# EAGLE design bl_dora2 (EAGLE 9.6.2)
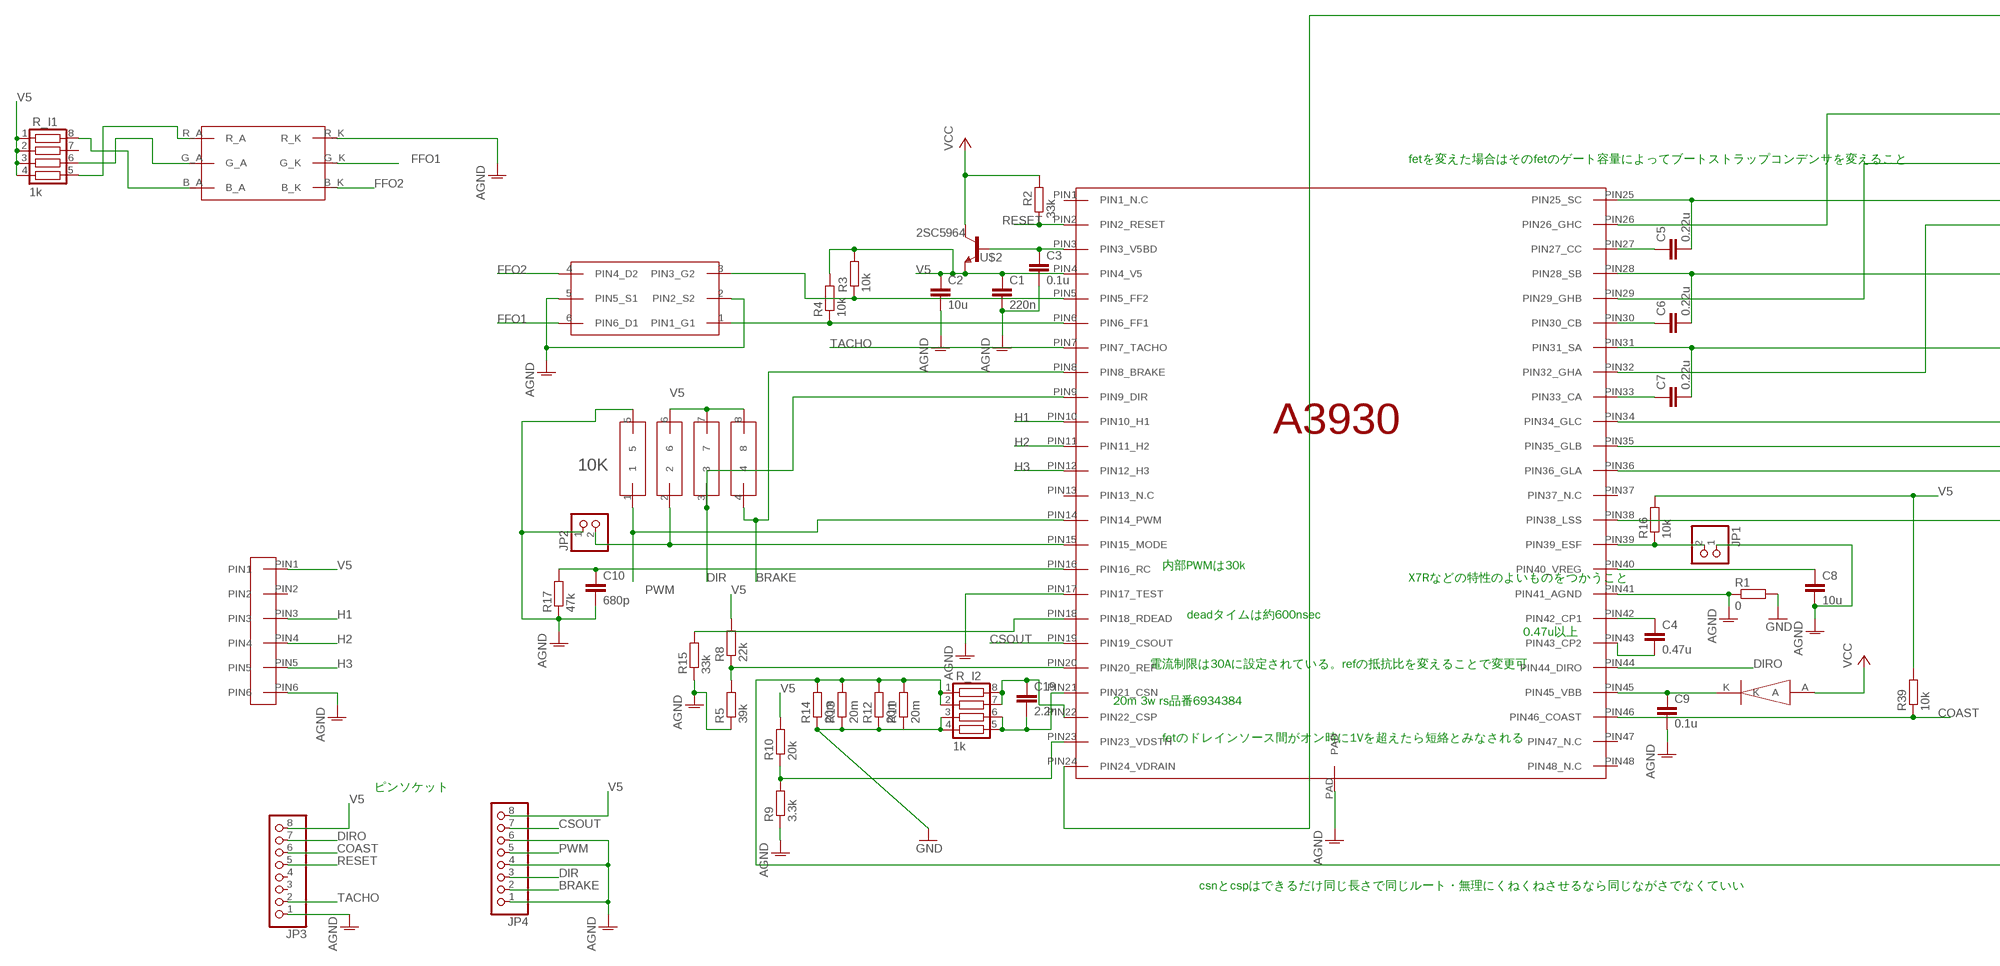
[diagram p0: schematic, sheet 1, part 1 of 2]
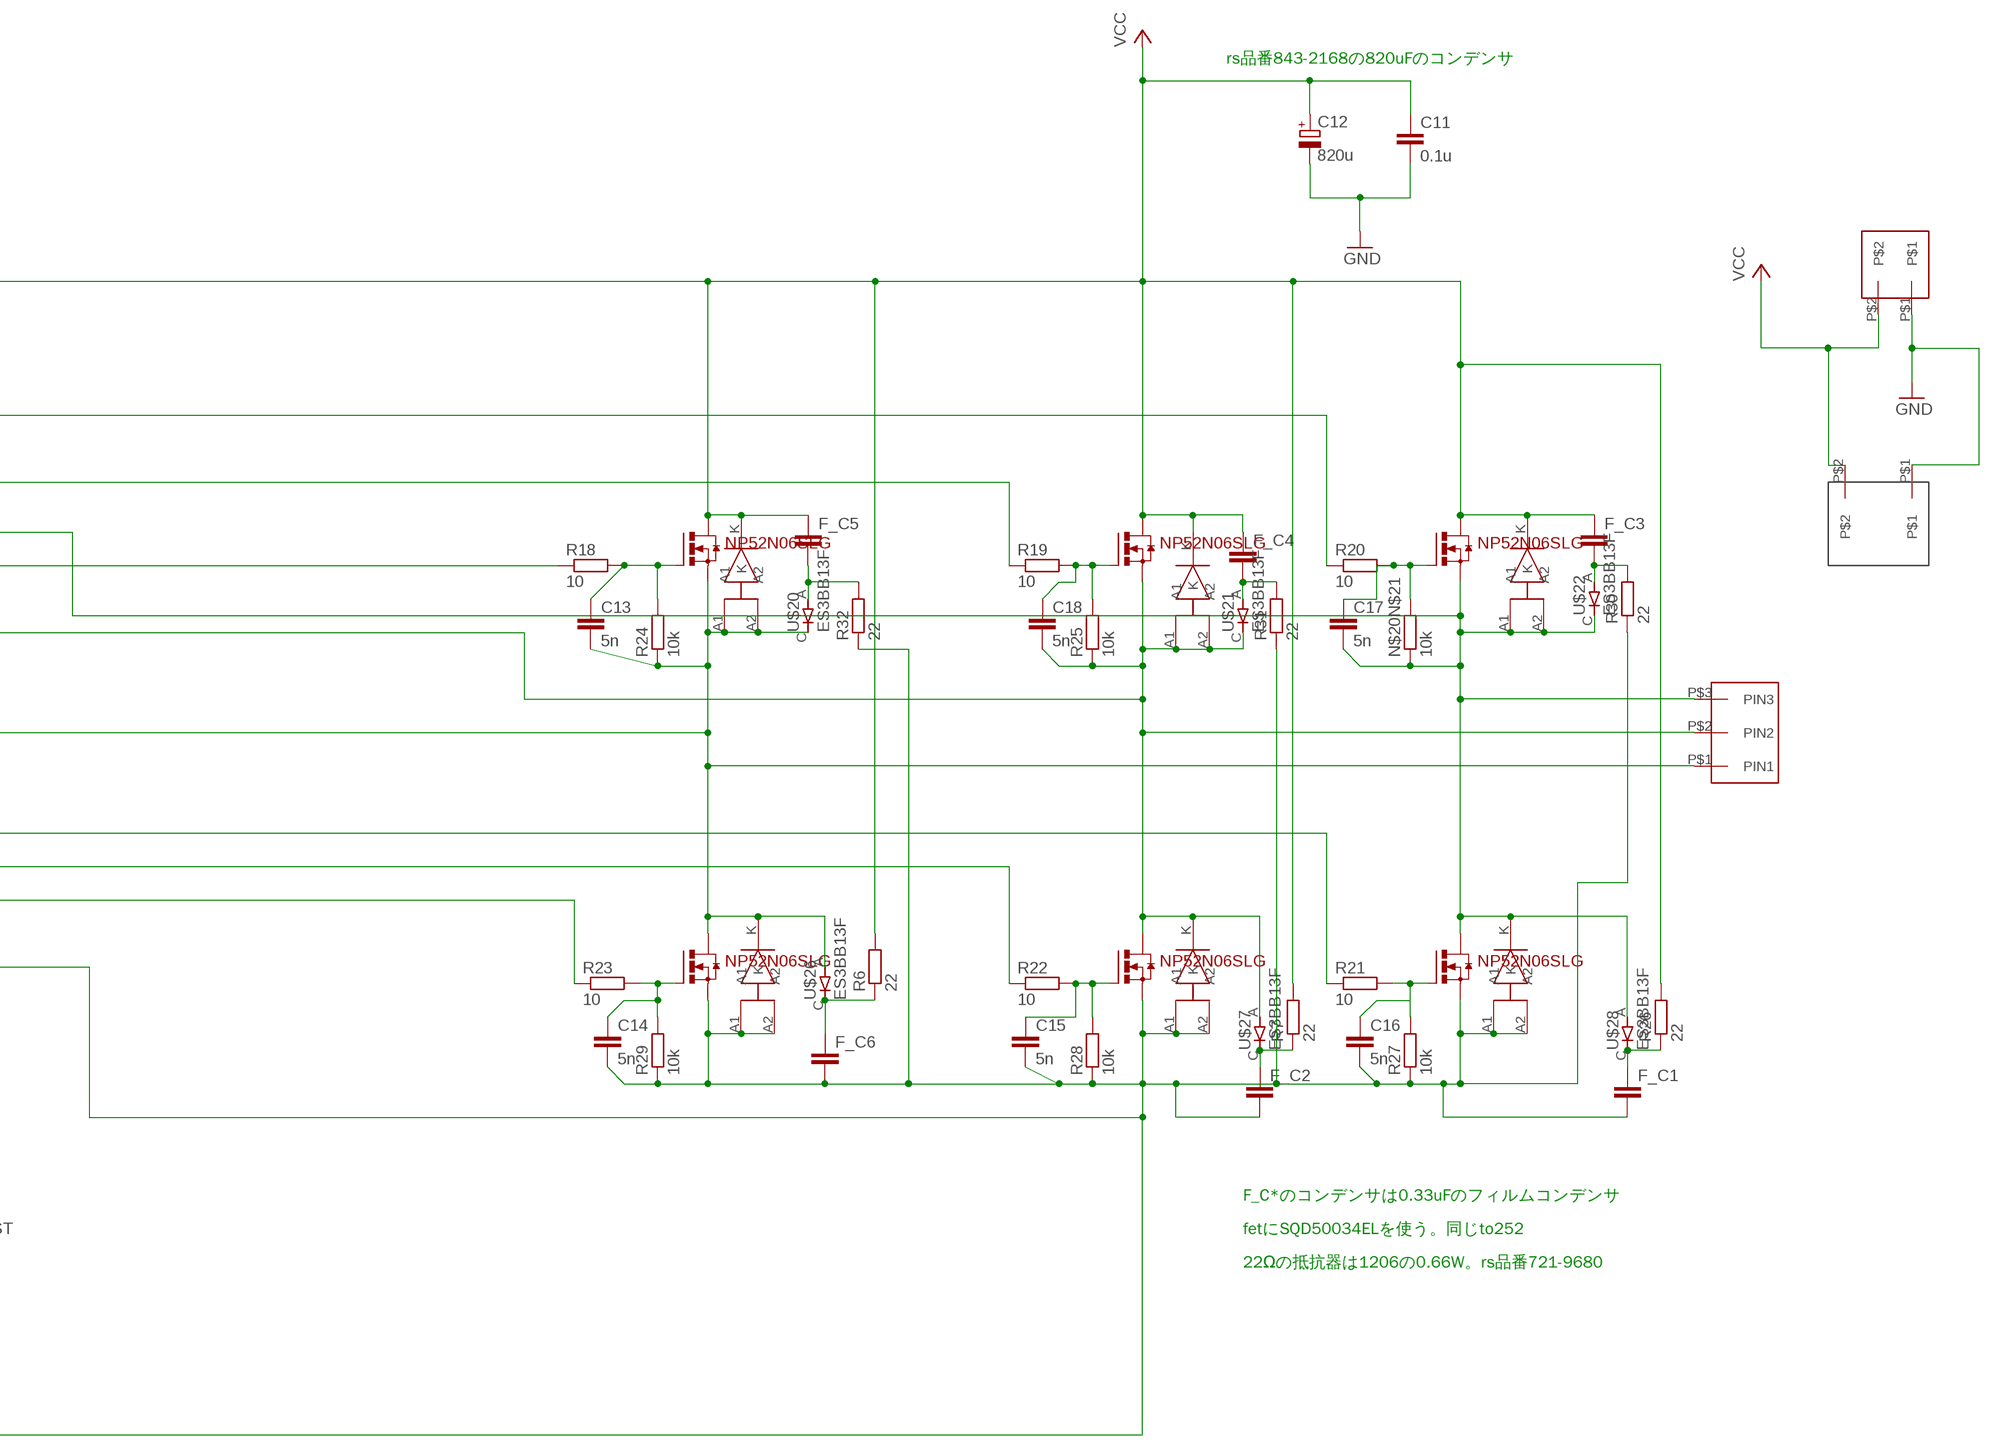
[diagram p1: schematic, sheet 1, part 2 of 2]

## Parts
C1  220n  C-EUC2012  [C2012]
C2  10u  C-EUC2012  [C2012]
C3  0.1u  C-EUC2012  [C2012]
C4  0.47u  C-EUC2012  [C2012]
C5  0.22u  C-EUC2012  [C2012]
C6  0.22u  C-EUC2012  [C2012]
C7  0.22u  C-EUC2012  [C2012]
C8  10u  C-EUC2012  [C2012]
C9  0.1u  C-EUC2012  [C2012]
C10  680p  C-EUC2012  [C2012]
C11  0.1u  C-EUC2012  [C2012]
C12  820u  CPOL-EU153CLV-1012  [153CLV-1012]
C13  5n  C-EUC2012  [C2012]
C14  5n  C-EUC2012  [C2012]
C15  5n  C-EUC2012  [C2012]
C16  5n  C-EUC2012  [C2012]
C17  5n  C-EUC2012  [C2012]
C18  5n  C-EUC2012  [C2012]
C19  2.2n  C-EUC1608  [C1608]
F_C1  FIL_CAPA  [FIL_CAPA]
F_C2  FIL_CAPA  [FIL_CAPA]
F_C3  FIL_CAPA  [FIL_CAPA]
F_C4  FIL_CAPA  [FIL_CAPA]
F_C5  FIL_CAPA  [FIL_CAPA]
F_C6  FIL_CAPA  [FIL_CAPA]
JP1  PINHD-1X2  [1X02]
JP2  PINHD-1X2  [1X02]
JP3  PINHD-1X8  [1X08]
JP4  PINHD-1X8  [1X08]
N$20N$21  10k  R-EU_M2012  [M2012]
R1  0  R-EU_M2012  [M2012]
R2  33k  R-EU_M2012  [M2012]
R3  10k  R-EU_M2012  [M2012]
R4  10k  R-EU_M2012  [M2012]
R5  39k  R-EU_M2012  [M2012]
R6  22  R-EU_R1206  [R1206]
R7  22  R-EU_R1206  [R1206]
R8  22k  R-EU_M2012  [M2012]
R9  3.3k  R-EU_M2012  [M2012]
R10  20k  R-EU_M2012  [M2012]
R11  20m  R-EU_R2512  [R2512]
R12  20m  R-EU_R2512  [R2512]
R13  20m  R-EU_R2512  [R2512]
R14  20m  R-EU_R2512  [R2512]
R15  33k  R-EU_M2012  [M2012]
R16  10k  R-EU_M2012  [M2012]
R17  47k  R-EU_M2012  [M2012]
R18  10  R-EU_M2012  [M2012]
R19  10  R-EU_M2012  [M2012]
R20  10  R-EU_M2012  [M2012]
R21  10  R-EU_M2012  [M2012]
R22  10  R-EU_M2012  [M2012]
R23  10  R-EU_M2012  [M2012]
R24  10k  R-EU_M2012  [M2012]
R25  10k  R-EU_M2012  [M2012]
R26  22  R-EU_R1206  [R1206]
R27  10k  R-EU_M2012  [M2012]
R28  10k  R-EU_M2012  [M2012]
R29  10k  R-EU_M2012  [M2012]
R30  22  R-EU_R1206  [R1206]
R31  22  R-EU_R1206  [R1206]
R32  22  R-EU_R1206  [R1206]
R39  10k  R-EU_M2012  [M2012]
R_I1  1k  0603X4RESISTOR  [0603X4RESISTOR]
R_I2  1k  R_SHUGOU  [0603X4RESISTOR]
U$1  A3930  [A3930]
U$2  2SC5964  [2SC5964]
U$3  SSOT6_FET  [SSOT6_FET]
U$4  RGB_LED  [RGB_LED]
U$5  10K  1005X4RESISTOR  [1005X4RESISTOR]
U$6  SMD_DAIOD  [SMD_DAIOD]
U$7  NP52N06SLG  [NP52N06SLG]
U$8  NP52N06SLG  [NP52N06SLG]
U$9  NP52N06SLG  [NP52N06SLG]
U$10  NP52N06SLG  [NP52N06SLG]
U$11  NP52N06SLG  [NP52N06SLG]
U$12  NP52N06SLG  [NP52N06SLG]
U$13  SBR10M100P5Q  [SBR10M100P5Q]
U$14  SBR10M100P5Q  [SBR10M100P5Q]
U$15  SBR10M100P5Q  [SBR10M100P5Q]
U$16  SBR10M100P5Q  [SBR10M100P5Q]
U$17  SBR10M100P5Q  [SBR10M100P5Q]
U$18  SBR10M100P5Q  [SBR10M100P5Q]
U$19  XH_2P  [XH_2P]
U$20  ES3BB13F  [ES3BB13F]
U$21  ES3BB13F  [ES3BB13F]
U$22  ES3BB13F  [ES3BB13F]
U$23  ZH_6P_L  [ZH_6P_L]
U$24  XT60  [XT60]
U$25  VL_3P  [VL_3P]
U$26  ES3BB13F  [ES3BB13F]
U$27  ES3BB13F  [ES3BB13F]
U$28  ES3BB13F  [ES3BB13F]

## Nets
AGND: C1.2 C2.2 C3.2 C8.2 C9.2 C10.2 JP1.1 JP2.1 JP3.1 JP4.1 JP4.4 JP4.6 R1.1 R5.1 R9.1 R15.1 R17.1 U$1.PAD U$1.PIN17(PIN17_TEST) U$1.PIN41(PIN41_AGND) U$3.2(PIN2_S2) U$3.5(PIN5_S1) U$4.R_K U$5.5 U$23.PIN6
BRAKE: JP4.2 U$1.PIN8(PIN8_BRAKE) U$5.4
COAST: JP3.6 R39.1 U$1.PIN46(PIN46_COAST)
CSOUT: JP4.7 U$1.PIN19(PIN19_CSOUT)
DIR: JP4.3 U$1.PIN9(PIN9_DIR) U$5.3
DIRO: JP3.7 U$1.PIN44(PIN44_DIRO)
ESF: JP1.2 R16.1 U$1.PIN39(PIN39_ESF)
FFO1: U$3.6(PIN6_D1) U$4.G_K
FFO2: U$3.4(PIN4_D2) U$4.B_K
GND: C11.2 C12.- R1.2 R11.1 R12.1 R13.1 R14.1 R_I2.3 R_I2.4 U$19.P$1 U$24.P$1
H1: U$1.PIN10(PIN10_H1) U$23.PIN3
H2: U$1.PIN11(PIN11_H2) U$23.PIN4
H3: U$1.PIN12(PIN12_H3) U$23.PIN5
N$1: C3.1 U$1.PIN3(PIN3_V5BD) U$2.B
N$2: R3.1 U$1.PIN5(PIN5_FF2) U$3.3(PIN3_G2)
N$3: R4.1 U$1.PIN6(PIN6_FF1) U$3.1(PIN1_G1)
N$4: R15.2 U$1.PIN18(PIN18_RDEAD)
N$5: F_C5.P$2 R32.2 U$20.A
N$6: C14.2 C15.2 C16.2 F_C1.P$2 F_C2.P$2 F_C6.P$2 R11.2 R12.2 R13.2 R14.2 R27.1 R28.1 R29.1 R30.1 R31.1 R32.1 R_I2.1 R_I2.2 U$1.PIN38(PIN38_LSS) U$8.PIN3_S U$10.PIN3_S U$12.PIN3_S U$14.A1 U$14.A2 U$15.A1 U$15.A2 U$18.A1 U$18.A2
N$7: R5.2 R8.1 U$1.PIN20(PIN20_REF)
N$9: C19.2 R_I2.5 R_I2.6 U$1.PIN21(PIN21_CSN)
N$10: R9.2 R10.1 U$1.PIN23(PIN23_VDSTH)
N$11: R_I1.5 U$4.R_A
N$12: C4.1 U$1.PIN42(PIN42_CP1)
N$13: JP2.2 U$1.PIN15(PIN15_MODE) U$5.2
N$14: C4.2 U$1.PIN43(PIN43_CP2)
N$16: C5.1 U$1.PIN27(PIN27_CC)
N$17: C6.1 U$1.PIN30(PIN30_CB)
N$18: C7.1 U$1.PIN33(PIN33_CA)
N$19: C7.2 C13.2 R24.1 U$1.PIN31(PIN31_SA) U$7.PIN3_S U$8.PIN2_D U$13.A1 U$13.A2 U$14.K U$20.C U$25.P$1(PIN1) U$26.A
N$20: C19.1 R_I2.7 R_I2.8 U$1.PIN22(PIN22_CSP)
N$21: R_I1.6 U$4.G_A
N$22: C8.1 U$1.PIN40(PIN40_VREG)
N$23: C9.1 U$1.PIN45(PIN45_VBB) U$6.K
N$24: C10.1 R17.2 U$1.PIN16(PIN16_RC)
N$25: C13.1 R18.2 R24.2 U$7.PIN1_G
N$26: C18.1 R19.2 R25.2 U$9.PIN1_G
N$27: C17.1 N$20N$21.2 R20.2 U$11.PIN1_G
N$28: C16.1 R21.2 R27.2 U$12.PIN1_G
N$29: C15.1 R22.2 R28.2 U$10.PIN1_G
N$30: C14.1 R23.2 R29.2 U$8.PIN1_G
N$31: R23.1 U$1.PIN36(PIN36_GLA)
N$32: R22.1 U$1.PIN35(PIN35_GLB)
N$33: R21.1 U$1.PIN34(PIN34_GLC)
N$34: R_I1.8 U$4.B_A
N$35: R18.1 U$1.PIN32(PIN32_GHA)
N$36: R19.1 U$1.PIN29(PIN29_GHB)
N$37: R20.1 U$1.PIN26(PIN26_GHC)
N$38: F_C4.P$2 R31.2 U$21.A
N$41: F_C3.P$2 R30.2 U$22.A
N$42: F_C6.P$1 R6.1 U$26.C
N$44: C5.2 C17.2 N$20N$21.1 U$1.PIN25(PIN25_SC) U$11.PIN3_S U$12.PIN2_D U$17.A1 U$17.A2 U$18.K U$22.C U$25.P$3(PIN3) U$28.A
N$45: F_C1.P$1 R26.1 U$28.C
N$47: F_C2.P$1 R7.1 U$27.C
N$50: C6.2 C18.2 R25.1 U$1.PIN28(PIN28_SB) U$9.PIN3_S U$10.PIN2_D U$15.K U$16.A1 U$16.A2 U$21.C U$25.P$2(PIN2) U$27.A
PWM: JP4.5 U$1.PIN14(PIN14_PWM) U$5.1
RESET: JP3.5 R2.1 U$1.PIN2(PIN2_RESET)
TACHO: JP3.2 U$1.PIN7(PIN7_TACHO)
V5: C1.1 C2.1 JP3.8 JP4.8 R3.2 R4.2 R8.2 R10.2 R16.2 R39.2 R_I1.1 R_I1.2 R_I1.3 R_I1.4 U$1.PIN4(PIN4_V5) U$2.E U$5.6 U$5.7 U$5.8 U$23.PIN1
VCC: C11.1 C12.+ F_C3.P$1 F_C4.P$1 F_C5.P$1 R2.2 R6.2 R7.2 R26.2 U$1.PIN24(PIN24_VDRAIN) U$2.C U$2.C@2(C) U$6.A U$7.PIN2_D U$9.PIN2_D U$11.PIN2_D U$13.K U$16.K U$17.K U$19.P$2 U$24.P$2
Unconnected: JP3.3 JP3.4 R_I1.7 U$1.PIN1(PIN1_N.C) U$1.PIN13(PIN13_N.C) U$1.PIN37(PIN37_N.C) U$1.PIN47(PIN47_N.C) U$1.PIN48(PIN48_N.C) U$23.PIN2

## Notes on the sheet
- rs品番843-2168の820uFのコンデンサ
- fetを変えた場合はそのfetのゲート容量によってブートストラップコンデンサを変えること
- 内部PWMは30k
- X7Rなどの特性のよいものをつかうこと
- deadタイムは約600nsec
- 0.47u以上
- 電流制限は30Aに設定されている。refの抵抗比を変えることで変更可
- F_C*のコンデンサは0.33uFのフィルムコンデンサ
- 20m 3w rs品番6934384
- fetにSQD50034ELを使う。同じto252
- fetのドレインソース間がオン時に1Vを超えたら短絡とみなされる | 22Ωの抵抗器は1206の0.66W。rs品番721-9680
- ピンソケット
- csnとcspはできるだけ同じ長さで同じルート・無理にくねくねさせるなら同じながさでなくていい

## Library data of the parts
C1-C11 C13-C19 = rcl:C-EU: CAPACITOR, European symbol; SPICEPREFIX: C
C12 = rcl:CPOL-EU: POLARIZED CAPACITOR, European symbol; SPICEPREFIX: C
F_C1-F_C6 = user:FIL_CAPA: メタライズドポリエステルコンデンサ 0.1u 100v 秋月電子通販コード[MEM104J101RB-5]
JP1 JP2 = pinhead:PINHD-1X2: PIN HEADER
JP3 JP4 = pinhead:PINHD-1X8: PIN HEADER
N$20N$21 R1-R32 R39 = rcl:R-EU_: RESISTOR, European symbol; SPICEPREFIX: R
R_I1 = user:0603X4RESISTOR: 工房に落ちてたやつ...どこが作った物なのかトレランスはどうなのかとか精級は全部不明
R_I2 = user_rcl:R_SHUGOU
U$1 = user:A3930
U$2 = user:2SC5964: rs品番774-0746 PCP
U$3 = user:SSOT6_FET
U$4 = user:RGB_LED: 秋月電子通商 I-12726
U$5 = user:1005X4RESISTOR
U$6 = user:SMD_DAIOD
U$7-U$12 = user:NP52N06SLG
U$13-U$18 = user:SBR10M100P5Q: digikeyに売ってるスーパーバリアダイオード 100V 10A
U$19 = user:XH_2P: トップ型xhコネクタ2ピン 秋月に売ってるやつ
U$20-U$22 U$26-U$28 = user:ES3BB13F: digikeyに売ってるダイオード 逆耐圧100V 定格電流3A 瞬間100A
U$23 = user:ZH_6P_L
U$24 = user:XT60
U$25 = user:VL_3P

## Board
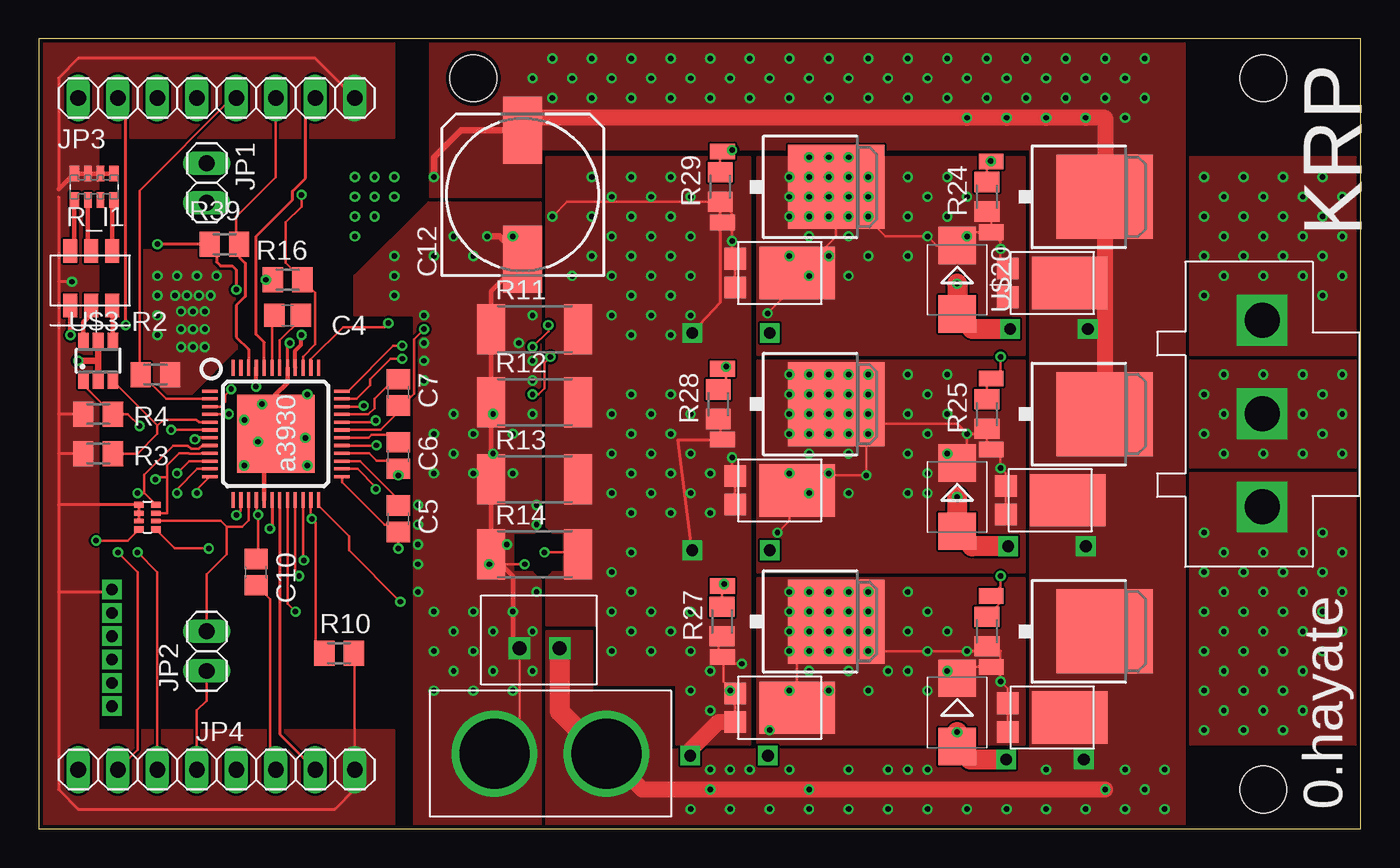
[diagram p2: board, top side]
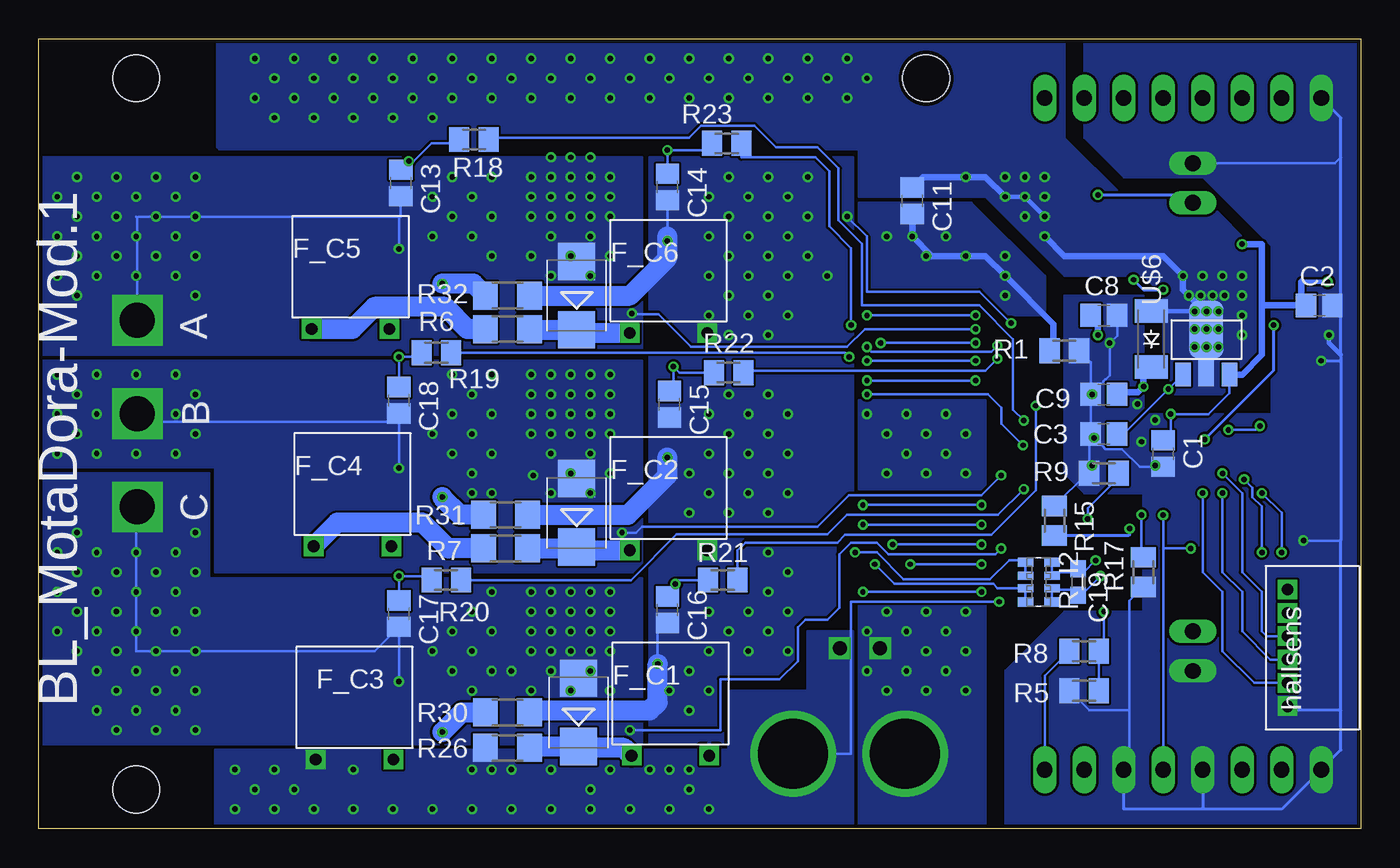
[diagram p3: board, bottom side, seen from below]

Size 85 x 50.79 mm. Coordinates in mm from the lower left corner, seen from the top.
Outline: 0,0 85,0 85,50.79 0,50.79 0,0
Copper layers (1*16): Top 0.035mm / dielectric 1.5mm / Bottom 0.035mm
Design rules "SeeedStudio_2layer_DRU_no_angle_20140221": minimum track width 6mil, minimum drill 12mil, track to track 6mil, track to pad 6mil, pad to pad 6mil, via to via 6mil, smd to smd 0mil, copper to edge 10mil, drill to drill 10mil, minimum pad ring 10mil, minimum via ring 6mil, stop-mask expansion 2mil, vias tented up to drill 100mil, thermal gap 10mil
Holes 3 mm at 78.74,2.54 78.74,48.26 27.94,48.26

### Footprints (pad centres in the part's own frame; a part is rotated, then mirrored left to right if it is on the bottom)
C2012 = smd 1.3 x 1.5: 1 -0.85,0; 2 0.85,0
153CLV-1012 = smd 4.3 x 2.5: + 4.15,0; - -4.15,0
C1608 = smd 1.1 x 1: 1 -0.85,0; 2 0.85,0
FIL_CAPA = drill 0.75 square: P$1 1.25,-0.75; P$2 6.25,-0.75
1X02 = drill 1.016 long: 1 -1.27,0; 2 1.27,0
1X08 = drill 1.016 long: 1 -8.89,0; 2 -6.35,0; 3 -3.81,0; 4 -1.27,0; 5 1.27,0; 6 3.81,0; 7 6.35,0; 8 8.89,0
M2012 = smd 1.3 x 1.6: 1 -0.95,0; 2 0.95,0
R1206 = smd 1.6 x 1.803: 1 -1.422,0; 2 1.422,0
R2512 = smd 1.8 x 3.2: 1 -2.8,0; 2 2.8,0
0603X4RESISTOR = smd 0.6 x 1: 1 -1.275,-0.85; 4 1.275,-0.85; 5 1.275,0.85; 8 -1.275,0.85 | smd 0.5 x 1: 2 -0.4,-0.85; 3 0.4,-0.85; 6 0.4,0.85; 7 -0.4,0.85
A3930 = smd 5 x 5: PAD 0,0 | smd 0.2 x 1: PIN1 -2.75,-4.25; PIN2 -2.25,-4.25; PIN3 -1.75,-4.25; PIN4 -1.25,-4.25; PIN5 -0.75,-4.25; PIN6 -0.25,-4.25; PIN7 0.25,-4.25; PIN8 0.75,-4.25; PIN9 1.25,-4.25; PIN10 1.75,-4.25; PIN11 2.25,-4.25; PIN12 2.75,-4.25; PIN25 2.75,4.25; PIN26 2.25,4.25; PIN27 1.75,4.25; PIN28 1.25,4.25; PIN29 0.75,4.25; PIN30 0.25,4.25; PIN31 -0.25,4.25; PIN32 -0.75,4.25; PIN33 -1.25,4.25; PIN34 -1.75,4.25; PIN35 -2.25,4.25; PIN36 -2.75,4.25 | smd 1 x 0.2: PIN13 4.25,-2.75; PIN14 4.25,-2.25; PIN15 4.25,-1.75; PIN16 4.25,-1.25; PIN17 4.25,-0.75; PIN18 4.25,-0.25; PIN19 4.25,0.25; PIN20 4.25,0.75; PIN21 4.25,1.25; PIN22 4.25,1.75; PIN23 4.25,2.25; PIN24 4.25,2.75; PIN37 -4.25,2.75; PIN38 -4.25,2.25; PIN39 -4.25,1.75; PIN40 -4.25,1.25; PIN41 -4.25,0.75; PIN42 -4.25,0.25; PIN43 -4.25,-0.25; PIN44 -4.25,-0.75; PIN45 -4.25,-1.25; PIN46 -4.25,-1.75; PIN47 -4.25,-2.25; PIN48 -4.25,-2.75
2SC5964 = smd 1 x 1.5: B 0,0; E 3,0 | smd 1 x 1.8: C 1.5,0.15 | smd 2.2 x 3.7: C@2 1.5,2.9
SSOT6_FET = smd 0.69 x 0.99: 1 -0.95,-1.3; 2 0,-1.3; 3 0.95,-1.3; 4 0.95,1.3; 5 0,1.3; 6 -0.95,1.3
RGB_LED = smd 1.5 x 0.9: B_A 3.5,-2.7; B_K 0,-2.7; G_A 3.5,-1.35; G_K 0,-1.35; R_A 3.5,0; R_K 0,0
1005X4RESISTOR = smd 0.4 x 0.6: 1 0.2,-0.8; 4 1.8,-0.8; 5 0.2,0.3; 8 1.8,0.3 | smd 0.3 x 0.6: 2 0.75,-0.8; 3 1.25,-0.8; 6 0.75,0.3; 7 1.25,0.3
SMD_DAIOD = smd 1.5 x 2.1: A 1.8,0; K -1.8,0
NP52N06SLG = smd 1 x 1.6: PIN1_G -2.28,-4.8; PIN3_S 2.28,-4.8 | smd 5.4 x 6.2: PIN2_D 0,2.5
SBR10M100P5Q = smd 1.39 x 1.4: A1 1.063,-0.177; A2 2.903,-0.177 | smd 3.36 x 4.86: K 1.983,3.805
XH_2P = drill 0.9 square: P$1 2.45,2.35; P$2 5.05,2.35
ES3BB13F = smd 2.4 x 2.4: A 2.2,0; C -2.2,0
ZH_6P_L = drill 0.75 square: PIN1 1.5,0; PIN2 3,0; PIN3 4.5,0; PIN4 6,0; PIN5 7.5,0; PIN6 9,0
XT60 = drill 4.5: P$1 11.35,4.05; P$2 4.15,4.05
VL_3P = drill 2.25 square: P$1 3.75,-3.25; P$2 9.75,-3.25; P$3 15.75,-3.25

### Placement (x,y rotation side)
C1  12.7,24.13 270 bottom
C2  2.67,33.66 0 bottom
C3  16.51,25.4 180 bottom
C4  16,33.02 180 top
C5  23.11,19.94 270 top
C6  23.11,24 270 top
C7  23.11,28.07 270 top
C8  16.51,33.02 0 bottom
C9  16.51,27.94 180 bottom
C10  13.97,16.51 270 top
C11  28.83,40.39 270 bottom
C12  31.11,40.77 90 top
C13  61.72,41.53 270 bottom
C14  44.58,41.27 270 bottom
C15  44.45,27.3 270 bottom
C16  44.58,14.1 270 bottom
C17  61.85,13.84 270 bottom
C18  61.85,27.56 270 bottom
C19  18.16,15.88 270 bottom
F_C1  48.13,5.46 0 bottom
F_C2  48.26,18.67 0 bottom
F_C3  68.45,5.21 0 bottom
F_C4  68.58,18.92 0 bottom
F_C5  68.71,32.89 0 bottom
F_C6  48.26,32.64 0 bottom
JP1  10.79,41.53 270 top
JP2  10.79,11.43 90 top
JP3  11.43,46.99 0 top
JP4  11.43,3.81 0 top
N$20N$21  60.96,12.7 90 top
R1  19.05,30.73 180 bottom
R2  7.49,29.21 0 top
R3  3.81,24.13 180 top
R4  3.81,26.67 180 top
R5  17.78,8.89 0 bottom
R6  54.86,32.13 180 bottom
R7  54.99,18.03 180 bottom
R8  17.78,11.43 180 bottom
R9  16.51,22.86 0 bottom
R10  19.3,11.3 0 top
R11  31.88,32.13 0 top
R12  31.88,27.43 0 top
R13  31.88,22.48 0 top
R14  31.88,17.65 0 top
R15  19.68,19.81 270 bottom
R16  16,35.31 180 top
R17  13.97,16.51 90 bottom
R18  57.02,44.32 180 bottom
R19  59.44,30.61 180 bottom
R20  58.8,16 180 bottom
R21  41.02,16 180 bottom
R22  40.64,29.34 180 bottom
R23  40.77,44.07 180 bottom
R24  60.96,40.64 90 top
R25  60.96,26.67 90 top
R26  54.86,5.21 180 bottom
R27  43.94,13.34 90 top
R28  43.69,27.3 90 top
R29  43.81,41.27 90 top
R30  54.86,7.49 180 bottom
R31  54.99,20.19 180 bottom
R32  54.86,34.29 180 bottom
R39  11.94,37.59 180 top
R_I1  3.56,41.27 180 top
R_I2  20.7,15.88 270 bottom
U$1  15.24,25.4 270 top
U$2  11.43,29.21 0 bottom
U$3  3.81,30.1 0 top
U$4  2.03,33.66 90 top
U$5  6.73,19.05 90 top
U$6  13.46,31.5 90 bottom
U$7  66.04,40.64 270 top
U$8  48.77,41.27 270 top
U$9  66.04,26.67 270 top
U$10  48.77,27.3 270 top
U$11  66.04,12.7 270 top
U$12  48.77,13.34 270 top
U$13  62.48,37.08 270 top
U$14  44.96,37.72 270 top
U$15  44.96,23.75 270 top
U$16  62.36,23.11 270 top
U$17  62.48,9.14 270 top
U$18  44.96,9.78 270 top
U$19  28.45,9.27 0 top
U$20  59.05,35.31 270 top
U$21  59.05,21.34 270 top
U$22  59.05,7.49 270 top
U$23  4.7,16.89 270 bottom
U$24  40.64,8.89 180 top
U$25  81.92,36.45 270 top
U$26  50.42,34.29 90 bottom
U$27  50.42,20.32 90 bottom
U$28  50.29,7.49 90 bottom

### Tracks (layer width: path | path; a pad name or v marks a point on that pad's centre or on a via)
AGND  (via drill 0.35)
  Top 0.152: JP2.1 10.79,8.26 10.16,7.62 JP4.4 | C10.2 14.86,14.77 14.86,4.19 JP4.6 | 14.61,24.77 15.18,25.34 U$1.PAD | U$5.5 5.72,18.54 v3.68,18.54
  Top 0.203: U$1.PIN41 15.99,31.1 v16.13,31.24
  Top 0.305: U$4.R_K v2.03,31.75 v2.04,31.75 | U$1.PIN17 14.49,24.65 14.61,24.77 | U$1.PIN41 15.99,28.69 15.18,27.88 15.18,25.34
  Top 0.406: U$3.5 3.81,30.1 | 3.81,30.1 v2.54,30.1 | 3.81,30.1 U$3.2
  Bottom 0.152: C3.2 16.54,24.58 16.54,24.55 16.41,24.42 15.35,24.42 14.21,23.28 C1.2 | C3.2 17.46,25.3 R9.1 17.59,22.86 R15.1 | C3.2 C9.2 | C9.2 16.54,28.76 16.54,28.79 16.41,28.92 16.38,28.92 16.13,29.17 v16.13,31.24 15.66,31.71 C8.2 | R17.1 14.86,14.67 14.86,7.62 | 14.86,7.62 14.86,4.19 JP4.6 | C9.2 17.36,29.99 R1.1 | v3.68,18.54 1.27,18.54 | R5.1 17.46,7.62 14.86,7.62 | JP1.1 1.65,42.8 1.27,43.18
  Bottom 0.2: JP4.6 15.24,1.27 10.16,1.27 | 10.16,1.27 5.08,1.27 JP4.1 1.27,5.08 1.27,7.62 | JP4.4 10.16,1.27 | 1.27,7.62 1.27,18.54 1.27,30.1 | 1.27,30.1 1.27,30.48 1.27,34.2 | 1.27,34.2 1.27,43.18 1.27,45.72 JP3.1 | C2.2 1.27,34.2 | v2.54,30.1 1.27,30.1 | U$23.PIN6 4.43,7.62 1.27,7.62
  Bottom 0.305: v2.04,31.75 2.04,31.25 1.27,30.48
  other vias: 13.21,26.29 14.35,27.3 17.14,25.15 17.27,27.94 17.27,23.37 14.1,24.89 13.21,23.37
  pour Bottom (no thermals): 17.78,50.8 0,50.8 0,0 22.86,0 22.86,10.16 19.05,13.97 13.97,13.97 13.97,21.59 17.78,21.59 19.05,22.86 19.05,34.29 13.97,34.29 13.97,26.67 5.71,26.67 5.71,37.47 10.16,41.91 15.24,41.91 17.78,44.45
BRAKE  (via drill 0.35)
  Top 0.152: U$5.4 6.77,21.61 | 6.77,21.61 6.77,22.77 8.65,24.65 9.57,24.65 9.78,24.44 10.28,24.44 10.5,24.65 U$1.PIN8 | 6.77,21.61 6.75,21.59 v6.35,21.59 | v5.08,17.78 6.35,16.51 6.35,5.08 JP4.2
  Bottom 0.152: v6.35,21.59 5.08,20.32 v5.08,17.78
COAST
  Top 0.152: JP3.6 15.24,41.91 12.7,39.37 12.7,37.59 R39.1
  Top 0.2: R39.1 12.89,36.76 13.28,36.37 13.28,34.23 12.7,33.66 12.7,31.62 13.49,30.83 U$1.PIN46
CSOUT
  Top 0.152: 15.49,19.31 15.49,19.3
  Top 0.203: U$1.PIN19 15.49,19.31 | 15.49,19.3 15.49,6.1 JP4.7
DIR  (via drill 0.35)
  Top 0.152: U$5.3 8.26,20.29 8.26,22.61 | U$1.PIN9 10.43,24.15 10.41,24.13 9.65,24.13 9.64,24.15 9.04,24.15 8.26,23.37 8.26,22.61 | v7.49,22.48 7.62,22.61 8.26,22.61 | v6.35,17.78 7.62,16.51 JP4.3
  Bottom 0.152: v6.35,17.78 6.35,20.73 6.96,21.34 6.96,21.94 v7.49,22.48
DIRO
  Top 0.2: 13.97,31.8 13.97,38.1 16.31,40.44 16.31,41.01 17.14,41.84
  Top 0.203: 17.14,41.84 17.14,46.35 JP3.7 | U$1.PIN44 14.49,31.28 13.97,31.8
ESF  (via drill 0.35)
  Top 0.152: U$1.PIN39 16.99,30.36 17.78,31.15 17.78,34.48 R16.1 15.88,36.38 15.88,38.99 16.89,40.01 v16.89,40.77
  Bottom 0.2: JP1.2 11.3,40.77 v16.89,40.77
FFO1
  Top 0.305: U$3.6 2.86,32.58 3.38,33.1 U$4.G_K
FFO2
  Top 0.305: U$4.B_K 4.76,33.63 U$3.4
GND  (via drill 0.35)
  Top 0.152: U$19.P$1 30.9,6.45 U$24.P$1 | 26.91,4.84 26.67,5.08 | v31.24,17.02 29.71,17.02
  Top 0.305: C12.- 29.08,34.58 R11.1 R12.1 R13.1 R14.1 29.71,17.02 30.48,16.25 v30.48,13.97 30.48,12.04 U$19.P$1
  Top 0.406: C12.- 29.63,38.1 v28.83,38.1
  Bottom 0.152: v24.38,20.83 v32,20.83 | v24.38,19.56 v32,19.56 | v24.38,18.29 v30.1,18.29 | v24.38,17.02 v28.96,17.02 | v24.38,15.24 v32,15.24 | v24.77,28.83 v31.75,28.83 | v24.77,33.02 v31.75,33.02 | v24.77,31.24 v30.86,31.24 | v24.77,30.1 v31.75,30.1 | R_I2.4 R_I2.3 23.35,15.47 23.62,15.75 29.97,15.75 v31.24,17.02
  Bottom 0.406: R1.2 19.75,30.99 19.75,32.45 v22.86,35.56 24.13,36.83 v25.4,36.83 27.56,36.83 v28.83,38.1 C11.2
  other vias: 22.86,36.83 22.86,34.29 31.75,26.67 26.67,38.1 30.48,38.1 27.94,36.83 26.67,26.67 25.4,25.4 25.4,22.86 26.67,24.13 27.94,22.86 30.48,22.86 29.21,24.13 27.94,25.4 30.48,25.4 29.21,26.67 25.4,13.97 27.94,13.97 31.75,12.7 29.21,12.7 26.67,12.7 25.4,11.43 27.94,11.43 26.67,10.16 25.4,8.89 27.94,8.89 30.48,8.89 31.75,10.16 29.21,10.16
  pour Top (no thermals): 25.02,40.26 32.26,40.26 32.26,19.43 31.88,19.05 30.48,19.05 30.48,16.51 31.75,16.51 32.26,16 32.26,0 24.13,0 24.13,33.02 20.32,33.02 20.32,35.56
  pour Bottom (no thermals): 24.13,0 32.26,0 32.26,14.35 24.13,14.35
  pour Bottom (no thermals): 20.32,33.02 20.32,35.56 25.02,40.26 32.26,40.26 32.26,34.54 24.13,34.54 24.13,33.02
  pour Bottom: 24.13,26.67 24.13,27.56 32.26,27.56 32.26,21.84 24.13,21.84
H1  (via drill 0.35)
  Top 0.152: v8.89,22.86 9.68,23.65 U$1.PIN10
  Bottom 0.152: v8.89,22.86 7.62,21.59 7.62,16.51 6.35,15.24 6.35,12.7 6.04,12.39 U$23.PIN3
H2  (via drill 0.35)
  Top 0.152: U$1.PIN11 10.2,23.15 8.89,21.84 v8.89,21.59
  Bottom 0.152: v8.89,21.59 8.89,16.51 7.62,15.24 7.62,12.7 5.81,10.89 U$23.PIN4
H3  (via drill 0.35)
  Top 0.152: v10.16,21.59 10.16,21.82 U$1.PIN12
  Bottom 0.152: v10.16,21.59 10.16,16.51 8.89,15.24 8.89,11.43 6.85,9.39 U$23.PIN5
N$1  (via drill 0.35)
  Top 0.152: v12.37,28.27 11.97,27.88 11.97,27.45 11.67,27.15 U$1.PIN3
  Bottom 0.152: C3.1 15.24,25.4 v12.37,28.27 U$2.B
N$2
  Top 0.152: U$3.3 7.62,25.94 7.62,25.91 | U$1.PIN5 10.3,26.15 10.13,26.32 8.03,26.32 7.62,25.91 | R3.1 6.35,24.13 7.62,25.4 7.62,25.91
N$3  (via drill 0.35)
  Top 0.152: U$3.1 2.86,28.57 R4.1 5.71,26.67 v6.48,25.91 | U$1.PIN6 v8.51,25.65
  Bottom 0.152: v8.51,25.65 6.73,25.65 v6.48,25.91
N$4  (via drill 0.35)
  Top 0.2: U$1.PIN18 14.99,19.43 v14.86,19.3
  Bottom 0.2: v14.86,19.3 14.86,18.92 14.92,18.86 R15.2
N$5  (via drill 0.35)
  Top 1.27: v59.05,35.05 U$20.A 60.02,32.14 F_C5.P$2
  Bottom 1.27: R32.2 57.05,35.05 v59.05,35.05
N$6  (via drill 0.35)
  Top 0.152: U$1.PIN38 17.49,30.19 19.56,32.26 22.23,32.26 v22.48,32.51 | 44.58,39.37 44.58,39.56 R29.1 33.98,40.33 v33.02,39.37 | 44.58,39.37 v44.58,37.8 44.58,36.86 U$14.A1 U$14.A2 | R28.1 43.84,26.2 43.84,25.15 | 43.84,25.15 43.84,25.02 43.85,25.02 U$10.PIN3_S 43.84,25.15 | R27.1 43.71,12.16 43.71,11.31 U$12.PIN3_S 44.02,11 | 44.02,11 44.4,10.62 v45.21,10.62 | U$8.PIN3_S 44.34,39.37 44.58,39.37 | U$18.A2 U$18.A1 44.02,9.48 44.02,11 | U$15.A2 U$15.A1 44.58,22.89 v44.58,23.88 | R14.2 34.55,17.78 v32.51,17.78
  Top 0.203: R29.1 43.81,33.84 F_C6.P$2 | F_C2.P$2 41.1,25.02 43.84,25.02
  Top 1.016: F_C1.P$2 41.88,5.05 43.71,6.88 U$18.A2
  Bottom 0.152: C14.2 44.58,38.1 v44.58,37.8 | C16.2 45.21,12.61 v45.21,10.62 | v22.48,32.51 24.51,34.54 31.75,34.54 31.75,38.1 v33.02,39.37 | R_I2.2 R_I2.1 21.68,17.28 22.6,17.28 23.82,16.05 29.39,16.05 31.11,17.78 v32.51,17.78
  Bottom 1.27: R30.1 53.31,7.62 45.72,7.62 45.21,8.13 v45.21,10.62 | R31.1 47.12,20.19 44.58,22.73 v44.58,23.88 | R32.1 46.99,34.29 44.58,36.7 44.58,38.1
  other vias: 39.37,24.13 40.64,41.91 38.1,36.83 40.64,34.29 36.83,21.59 39.37,26.67 36.83,26.67 38.1,27.94 38.1,22.86 36.83,24.13 41.91,13.97 39.37,11.43 38.1,12.7 36.83,13.97 36.83,11.43 35.56,41.91 38.1,41.91 39.37,40.64 36.83,40.64 41.91,40.64 40.64,39.37 41.91,38.1 40.64,36.83 39.37,38.1 38.1,39.37 36.83,38.1 35.56,39.37 35.56,36.83 34.29,35.56 36.83,35.56 39.37,35.56 41.91,35.56 39.37,33.02 38.1,34.29 36.83,33.02 38.1,31.75 40.64,31.75 41.91,33.02 40.64,27.94 41.91,26.67 40.64,25.4 38.1,25.4 41.91,24.13 40.64,22.86 43.18,22.86 41.91,21.59 43.18,20.32 40.64,20.32 39.37,21.59 38.1,20.32 38.1,17.78 36.83,16.51 38.1,15.24 39.37,13.97 40.64,12.7 41.91,11.43 43.18,10.16 41.91,8.89 43.18,7.62 44.45,8.89
  pour Top (no thermals): 32.64,43.18 45.72,43.18 45.72,5.46 41.02,5.46 41.02,9.27 35.94,9.27 35.94,13.08 32.64,13.08 32.64,16.13 33.02,16.51 33.66,16.51 33.78,16.64 33.78,18.92 33.66,19.05 33.02,19.05 32.64,19.43
  pour Bottom (no thermals): 32.64,43.18 45.72,43.18 45.72,9.27 35.94,9.27 35.94,13.08 33.27,13.08 33.27,16.51 33.78,17.02 33.78,18.92 33.66,19.05 33.02,19.05 32.64,19.43
  pour Bottom: 41.02,9.14 41.02,5.46 45.72,5.46 45.72,9.14
N$7  (via drill 0.35)
  Top 0.152: U$1.PIN20 15.99,14.49 v16.51,13.97
  Bottom 0.152: v16.51,13.97 16.51,11.75 R8.1 R5.2
N$9  (via drill 0.35)
  Top 0.152: U$1.PIN21 16.49,16.5 v16.74,16.26
  Bottom 0.152: R_I2.5 19.85,15.37 | 19.85,15.37 R_I2.6 | 19.85,15.37 18.5,15.37 C19.2 17.97,15.03 v16.74,16.26
N$10  (via drill 0.35)
  Top 0.152: R10.1 17.8,11.86 17.8,19.68 v17.55,19.94 17.49,20 U$1.PIN23
  Bottom 0.152: R9.2 15.56,22.61 17.55,20.62 v17.55,19.94
N$11
  Top 0.305: R_I1.5 2.28,37.4 U$4.R_A
N$12
  Top 0.152: C4.1 16.85,32.77 15.49,31.41 U$1.PIN42
N$13
  Top 0.152: U$1.PIN15 13.49,19.84 13.08,19.43 12.06,19.43 | JP2.2 10.79,16.38 12.06,17.65 12.06,19.43 | U$5.2 11.7,19.8 12.06,19.43
N$14
  Top 0.152: C4.2 14.99,32.86 U$1.PIN43
N$16
  Top 0.152: C5.1 23.11,21.21 20.67,23.65 U$1.PIN27
N$17
  Top 0.152: U$1.PIN30 21.21,25.15 21.41,25.35 22.62,25.35 C6.1
N$18
  Top 0.152: C7.1 22.86,28.92 21.59,27.65 21.59,27.05 21.19,26.65 U$1.PIN33
N$19  (via drill 0.35)
  Top 0.152: U$1.PIN31 21.97,25.65 23.11,26.8 C7.2 23.37,27.22 24.13,27.98 24.13,31.5 v24.77,32.13 | R24.1 61.24,39.41 U$7.PIN3_S | U$7.PIN3_S 61.85,37.75 v61.85,37.29 61.85,36.48 U$13.A1 U$13.A2 | v46.86,33.15 48.76,35.05 48.76,35.56 | 48.76,35.56 U$14.K | U$7.PIN3_S 59.91,38.36 U$20.C 57.74,37.51 v57.15,38.1 54.44,38.1 U$8.PIN2_D 51.27,38.06 48.76,35.56
  Bottom 0.152: C13.2 61.72,39.37 61.85,39.37 | 61.85,39.37 v61.85,37.29 | U$25.P$1 78.67,39.3 | 78.67,39.3 78.74,39.37 | 78.67,39.3 78.59,39.37 v77.47,39.37 v74.93,39.37 61.85,39.37 | v46.86,33.15 46.81,33.1 45.16,33.1 43.05,30.99 33.02,30.99 31.88,32.13 v24.77,32.13
  other vias: 74.93,41.91 77.47,41.91 80.01,41.91 82.55,41.91 83.82,40.64 82.55,39.37 81.28,40.64 80.01,39.37 78.74,40.64 76.2,40.64 76.2,38.1 78.74,38.1 81.28,38.1 83.82,38.1 82.55,36.83 83.82,35.56 82.55,34.29 81.28,35.56 80.01,36.83 78.74,35.56 77.47,36.83 74.93,36.83 76.2,35.56 74.93,34.29 57.15,40.64 55.88,36.83 55.88,41.91 58.42,41.91 59.69,40.64 58.42,39.37 55.88,39.37 59.69,38.1 49.53,35.56 52.07,35.56 53.34,36.83 50.8,36.83 48.26,36.83 49.53,38.1 52.07,38.1 53.34,39.37 52.07,39.37 50.8,39.37 49.53,39.37 48.26,39.37 48.26,40.64 48.26,41.91 49.53,41.91 50.8,41.91 52.07,41.91 53.34,41.91 53.34,40.64 52.07,40.64 50.8,40.64 49.53,40.64 49.53,43.18 50.8,43.18 52.07,43.18
  pour Top (no thermals): 46.23,43.18 63.37,43.18 63.37,30.48 46.23,30.48
  pour Bottom (no thermals): 46.23,43.18 85.09,43.18 85.09,30.48 46.23,30.48
  pour Top (no thermals): 74.04,43.18 85.09,43.18 85.09,30.48 74.04,30.48
N$20  (via drill 0.35)
  Top 0.152: v17.05,17.27 16.99,17.33 U$1.PIN22
  Bottom 0.152: R_I2.8 19.85,16.51 | 19.85,16.51 R_I2.7 | v17.05,17.27 17.81,16.51 18.05,16.51 18.16,16.62 C19.1 18.38,16.51 19.85,16.51
N$21
  Top 0.305: R_I1.6 3.16,37.38 U$4.G_A
N$22  (via drill 0.35)
  Top 0.254: U$1.PIN40 16.49,30.75 16.86,31.12 16.86,31.72 v16.89,31.75
  Bottom 0.406: v16.89,31.75 16.89,32.55 C8.1
N$23  (via drill 0.35)
  Top 0.152: 13.97,29.63 U$1.PIN45
  Top 0.254: v13.97,28.43 13.97,29.63
  Bottom 0.254: U$6.K 13.97,29.19
  Bottom 0.406: 13.97,29.19 v13.97,28.43 14.33,28.07 15.53,28.07 C9.1
N$24  (via drill 0.35)
  Top 0.152: U$1.PIN16 13.99,20.3 v14.1,20.19 14.1,17.49 C10.1
  Bottom 0.152: v14.1,20.19 14.1,17.59 R17.2
N$25  (via drill 0.35)
  Top 0.152: R24.2 60.96,42.64 U$7.PIN1_G v61.21,42.93
  Bottom 0.152: C13.1 61.72,42.42 v61.21,42.93 60.89,42.93 59.75,44.07 58.23,44.07 R18.2
N$26  (via drill 0.35)
  Top 0.152: v61.85,30.35 61.85,29.18 61.62,28.95 U$9.PIN1_G 60.97,29.22 60.96,29.21 R25.2
  Bottom 0.152: R19.2 60.64,30.35 v61.85,30.35 C18.1
N$27  (via drill 0.35)
  Top 0.152: N$20N$21.2 61.85,14.54 v61.85,16.26 61.85,15.59 U$11.PIN1_G
  Bottom 0.152: R20.2 60.01,16.26 v61.85,16.26 C17.1
N$28  (via drill 0.35)
  Top 0.152: v44.07,15.75 44.07,15.62 U$12.PIN1_G 43.94,15.59 R27.2
  Bottom 0.152: C16.1 44.07,15.46 v44.07,15.75 44.07,16 R21.2
N$29  (via drill 0.35)
  Top 0.152: R28.2 44.2,28.76 v44.2,29.72 44.1,29.72 U$10.PIN1_G
  Bottom 0.152: R22.2 43.81,29.34 v44.2,29.72 44.2,28.41 C15.1
N$30  (via drill 0.35)
  Top 0.152: R29.2 43.81,43.4 U$8.PIN1_G 44.58,43.55 v44.58,43.64
  Bottom 0.152: C14.1 v44.58,43.64 42.15,43.64 R23.2
N$31  (via drill 0.35)
  Top 0.152: v32.77,32.38 32.77,32 v31.75,30.99 | U$1.PIN36 19.88,28.15 22.79,31.07 v23.37,31.07
  Bottom 0.152: v23.37,31.07 23.75,30.69 31.45,30.69 v31.75,30.99 | v32.77,32.38 32.77,37.34 34.16,38.73 34.16,42.29 35.05,43.18 39.82,43.18 R23.1
N$32  (via drill 0.35)
  Top 0.152: U$1.PIN35 20.42,27.65 21.29,28.52 21.29,28.91 22.61,30.23 v23.37,30.23
  Bottom 0.152: R22.1 39.56,29.46 24.13,29.46 v23.37,30.23
N$33  (via drill 0.35)
  Top 0.152: U$1.PIN34 20.84,27.15 v20.89,27.21
  Bottom 0.152: R21.1 40.07,17.91 39.56,18.41 33.66,18.41 33.15,18.92 23.75,18.92 20.89,21.78 v20.89,27.21
N$34
  Top 0.305: R_I1.8 4.73,40.33 U$4.B_A
N$35  (via drill 0.35)
  Top 0.152: U$1.PIN32 19.51,26.13 21.53,26.13 v21.66,26.26
  Bottom 0.152: v21.66,26.26 22.35,26.95 22.35,31.5 24.51,33.66 32.05,33.66 32.05,37.62 33.58,39.14 33.58,42.47 34.92,43.81 37.59,43.81 38.99,45.21 42.42,45.21 43.18,44.45 55.88,44.45 56.01,44.32 R18.1
N$36  (via drill 0.35)
  Top 0.152: U$1.PIN29 21.7,24.65 v21.72,24.67 | v32.89,30.35 32.51,29.97 32.51,28.32 32.13,27.94 v31.75,27.94
  Bottom 0.152: v31.75,27.94 23.98,27.94 23.11,27.08 23.11,26.06 v21.72,24.67 | v32.89,30.35 33.15,30.61 R19.1
N$37  (via drill 0.35)
  Top 0.152: U$1.PIN26 20.48,23.15 21.66,21.97 v21.66,21.84
  Bottom 0.152: v21.66,21.84 23.32,20.19 33.02,20.19 34.28,18.94 43.99,18.94 46.92,16 R20.1
N$38  (via drill 0.35)
  Top 1.27: F_C4.P$2 60.02,18.17 U$21.A v59.05,21.34
  Bottom 1.27: R31.2 57.91,20.19 v59.05,21.34
N$41  (via drill 0.35)
  Top 1.27: F_C3.P$2 59.89,4.46 U$22.A v59.05,6.22
  Bottom 1.27: v59.05,6.22 57.78,7.49 R30.2
N$42
  Bottom 1.27: R6.1 53.4,32.09 U$26.C 50.22,31.89 F_C6.P$1
N$44  (via drill 0.35)
  Top 0.152: v23.11,18.03 C5.2 22.64,19.56 22.23,19.56 19.49,22.29 U$1.PIN25 | N$20N$21.1 60.96,11.43 | 61.85,11.43 v61.85,9.48 | v61.85,9.48 61.85,9.81 U$11.PIN3_S 59.78,10.42 U$22.C | v59.69,11.43 58.42,11.43 v57.15,11.43 55.88,11.43 v53.34,11.43 53.17,11.43 U$12.PIN2_D 48.76,10.83 U$18.K 48.44,7.8 v46.99,6.35 | U$17.A2 U$17.A1 62.31,9.02 v61.85,9.48
  Top 0.203: 61.85,11.43 60.96,11.43 v59.69,11.43
  Bottom 0.152: v61.85,9.48 C17.2 63.41,11.43 v74.93,11.43 v77.47,11.43 78.74,11.43 v78.74,12.7 v78.74,15.24 v78.74,17.78 78.74,20.62 U$25.P$3 | v23.11,18.03 23.5,17.65 30.35,17.65 31.11,18.41 32.77,18.41 33.53,17.65 33.53,14.22 34.29,13.46 35.69,13.46 36.2,12.95 36.2,10.79 37.36,9.63 41.17,9.63 41.17,6.35 v46.99,6.35 | 49.53,8.89 49.43,8.99
  other vias: 57.15,13.97 55.88,10.16 57.15,8.89 74.93,19.05 76.2,17.78 81.28,17.78 82.55,19.05 83.82,17.78 82.55,16.51 83.82,15.24 83.82,12.7 82.55,11.43 81.28,10.16 81.28,7.62 80.01,6.35 77.47,6.35 74.93,6.35 76.2,7.62 78.74,7.62 80.01,8.89 77.47,8.89 74.93,8.89 76.2,10.16 78.74,10.16 80.01,11.43 81.28,12.7 76.2,12.7 74.93,13.97 77.47,13.97 80.01,13.97 82.55,13.97 81.28,15.24 76.2,15.24 74.93,16.51 77.47,16.51 80.01,16.51 55.88,15.24 58.42,12.7 55.88,12.7 58.42,10.16 48.26,15.24 49.53,15.24 50.8,15.24 52.07,15.24 53.34,15.24 53.34,13.97 52.07,13.97 50.8,13.97 49.53,13.97 48.26,13.97 48.26,12.7 49.53,12.7 50.8,12.7 52.07,12.7 53.34,12.7 52.07,11.43 50.8,11.43 49.53,11.43 48.26,11.43 52.07,10.16 48.26,8.89 53.34,8.89 54.61,10.16 49.53,10.16 50.8,8.89
  pour Top (no thermals): 63.37,16.13 63.37,5.46 46.23,5.46 46.23,16.13
  pour Bottom (no thermals): 74.04,22.86 85.09,22.86 85.09,5.46 46.23,5.46 46.23,16.13 74.04,16.13
  pour Top (no thermals): 74.93,22.86 85.09,22.86 85.09,5.46 74.04,5.46 74.04,22.86
N$45
  Bottom 1.016: 50.38,5.21 U$28.C
  Bottom 1.27: F_C1.P$1 47.38,5.21 50.38,5.21 | U$28.C 53.36,5.29 R26.1
N$47
  Bottom 1.016: U$27.C 50.22,17.92
  Bottom 1.27: R7.1 50.51,18.03 U$27.C | 50.22,17.92 F_C2.P$1
N$50  (via drill 0.35)
  Top 0.152: U$1.PIN28 21.23,24.15 21.72,23.66 22.61,23.66 C6.2 v23.11,22.73 | R25.1 60.96,25.4 60.96,24.67 U$9.PIN3_S 61.62,24.39 61.85,24.16 v61.85,23.19 62.18,22.86 U$16.A1 U$16.A2 | 47.76,20.32 48.77,20.32 | 59.05,26.04 52.54,26.04 U$10.PIN2_D 53.21,25.36 v53.21,22.73 49.73,22.73 U$15.K 48.44,21.77 48.26,21.59 48.26,19.81 v47.5,19.05 | U$21.C 59.69,24.17 v59.69,25.4
  Top 0.203: 59.05,26.04 v59.69,25.4 60.96,25.4
  Bottom 0.152: v23.11,22.73 24.38,21.46 32.89,21.46 34.92,19.43 46.23,19.43 46.61,19.05 v47.5,19.05 | v61.85,23.19 C18.2 61.85,26.16 78.13,26.16 U$25.P$2
  other vias: 55.88,29.21 58.42,29.21 57.15,27.94 58.42,26.67 55.88,26.67 57.15,25.4 55.88,24.13 57.15,22.86 57.15,21.59 55.88,21.59 74.93,25.4 74.93,27.94 76.2,29.21 78.74,29.21 81.28,29.21 83.82,29.21 82.55,27.94 83.82,26.67 82.55,25.4 83.82,24.13 81.28,26.67 81.28,24.13 78.74,24.13 76.2,24.13 76.2,26.67 58.42,24.13 52.07,21.59 48.26,22.86 49.53,21.59 52.07,24.13 49.53,24.13 48.26,25.4 49.53,25.4 50.8,25.4 52.07,25.4 53.34,25.4 53.34,26.67 52.07,26.67 50.8,26.67 49.53,26.67 48.26,26.67 48.26,27.94 49.53,27.94 50.8,27.94 52.07,27.94 53.34,27.94 53.34,29.21 52.07,29.21 50.8,29.21 49.53,29.21 48.26,29.21 50.8,22.86
  pour Top (no thermals): 63.37,16.51 46.23,16.51 46.23,30.1 63.37,30.1
  pour Bottom (no thermals): 46.23,16.51 73.66,16.51 73.66,23.24 84.71,23.24 84.96,23.5 84.96,30.1 46.23,30.1
  pour Top (no thermals): 74.04,30.1 85.09,30.1 85.09,23.24 74.04,23.24
PWM  (via drill 0.35)
  Top 0.152: U$5.1 8.75,18.03 v10.92,18.03 | v12.7,20.17 12.99,20.46 U$1.PIN14
  Bottom 0.152: v12.7,20.17 12.7,18.03 | 12.7,18.03 12.7,11.43 JP4.5 | v10.92,18.03 12.7,18.03
RESET
  Top 0.152: JP3.5 12.45,46.99 6.48,41.02 6.48,29.28 R2.1 6.63,29.21 8.19,27.65 U$1.PIN2
TACHO  (via drill 0.35)
  Top 0.152: 5.59,46.48 JP3.2
  Top 0.203: v10.03,25.04 10.14,25.15 U$1.PIN7 | v5.59,32.38 5.59,46.48
  Bottom 0.203: v10.03,25.04 5.59,29.49 v5.59,32.38
V5  (via drill 0.35)
  Top 0.152: v12.21,26.67 12.19,26.65 U$1.PIN4 | R10.2 20.32,11.24 JP4.8
  Top 0.2: JP3.8 17.78,49.53 2.54,49.53 1.27,48.26 1.27,41.11 | JP4.8 20.32,2.54 19.05,1.27 2.54,1.27 1.27,2.54 1.27,15.24 | 1.27,40.64 1.27,35.18 | 1.27,35.18 1.27,26.67 | 1.27,26.67 1.27,24.13 | 1.27,24.13 1.27,20.85 U$5.8 U$5.7 U$5.6 | R4.2 1.27,26.67 | R3.2 1.27,24.13 | v2.13,35.18 1.27,35.18 | 1.27,20.83 1.27,15.24 | v14.61,35.31 R16.2 | v7.62,37.59 R39.2 11.43,37.15 11.43,36.45 11.68,36.2 12.45,36.2 12.7,35.94 v12.7,34.67 | U$23.PIN1 4.55,15.24 1.27,15.24
  Top 0.305: R_I1.1 R_I1.2 R_I1.3 R_I1.4 1.27,41.11
  Bottom 0.152: C1.1 12.21,25.47 v12.21,26.67 9.78,26.67 8.43,28.02 U$2.E | R8.2 20.32,9.84 JP4.8
  Bottom 0.2: v14.61,35.31 13.97,34.67 v12.7,34.67
  Bottom 0.305: v2.13,35.18 3.81,35.18
  Bottom 0.406: U$2.E 7.62,29.21 6.35,30.48 6.35,33.66 | 6.35,33.66 C2.1 3.81,33.95 3.81,35.18 | 6.35,33.66 6.35,37.59 v7.62,37.59
  pour Top (no thermals): 3.81,44.45 22.86,44.45 22.86,50.8 0,50.8 0,0 22.86,0 22.86,6.35 3.81,6.35
VCC  (via drill 0.35)
  Top 0.152: U$1.PIN24 17.99,20.77 19.94,18.82 19.94,17.91 v23.24,14.61 | U$7.PIN2_D 68.58,40.64
  Top 0.406: v25.4,41.91 25.4,43.18 27.14,44.92 C12.+
  Top 1.016: U$9.PIN2_D 68.58,26.71 68.58,40.64 68.58,45.72 v67.31,45.72 v64.77,45.72 v62.23,45.72 v59.69,45.72 31.92,45.72 C12.+ | U$24.P$2 38.79,2.54 v43.18,2.54 v49.53,2.54 v68.58,2.54
  Top 1.27: U$19.P$2 33.5,7.56 36.22,4.84 U$24.P$2
  Bottom 0.152: U$2.C@2 9.12,32.11 | U$24.P$2 32.77,4.84 32.77,14.61 v23.24,14.61
  Bottom 0.305: U$2.C@2 9.93,33.27 13.44,33.27 U$6.A | v22.86,40.64 v21.59,40.64 v20.32,39.37
  Bottom 0.406: C11.1 28.16,41.91 v25.4,41.91 24.13,41.91 v22.86,40.64 | U$2.C@2 9.93,33.17 v11.05,34.29 11.43,34.67 v11.43,35.56 12.7,36.83 19.05,36.83 v20.32,38.1
  Bottom 1.27: R7.2 58.67,18.03 60.33,19.68 65.82,19.68 F_C4.P$1 | F_C5.P$1 67.44,32.13 64.84,32.13 63.41,33.56 58.88,33.56 57.45,32.13 R6.2
  other vias: 7.62,31.75 22.86,41.91 21.59,41.91 20.32,41.91 20.32,40.64 21.59,39.37 41.91,1.27 44.45,3.81 44.45,1.27 52.07,3.81 54.61,3.81 64.77,3.81 69.85,3.81 69.85,1.27 71.12,2.54 72.39,1.27 72.39,3.81 34.29,48.26 35.56,49.53 38.1,49.53 36.83,48.26 39.37,48.26 40.64,49.53 41.91,48.26 43.18,49.53 44.45,48.26 45.72,49.53 46.99,48.26 48.26,49.53 49.53,48.26 50.8,49.53 52.07,48.26 53.34,49.53 54.61,48.26 55.88,49.53 57.15,48.26 58.42,49.53 59.69,48.26 63.5,49.53 62.23,48.26 60.96,49.53 66.04,49.53 67.31,48.26 68.58,49.53 71.12,49.53 71.12,46.99 33.02,49.53 31.75,48.26 33.02,46.99 35.56,46.99 38.1,46.99 40.64,46.99 43.18,46.99 45.72,46.99 48.26,46.99 50.8,46.99 53.34,46.99 55.88,46.99 58.42,46.99 60.96,46.99 63.5,46.99 64.77,48.26 66.04,46.99 68.58,46.99 69.85,45.72 69.85,48.26 67.31,1.27 64.77,1.27 62.23,1.27 59.69,1.27 57.15,3.81 55.88,3.81 57.15,1.27 54.61,1.27 52.07,1.27 49.53,1.27 48.26,3.81 46.99,1.27 45.72,3.81 43.18,3.81 8.89,35.56 7.62,35.56 9.53,34.29 10.29,34.29 10.67,33.27 10.67,32.13 9.91,32.13 10.67,30.99 9.14,33.27 9.14,32.13 10.16,35.56 7.62,33.02 8.76,34.29 7.62,34.29 9.91,33.27 9.14,30.99 9.91,30.99
  pour Bottom (no thermals): 6.48,27.94 12.7,27.94 12.7,34.29 13.97,35.56 19.05,35.56 24.13,40.64 32.26,40.64 32.26,50.8 19.05,50.8 19.05,44.45 15.24,40.64 10.16,40.64 6.48,36.96
  pour Top (no thermals): 32.64,12.7 35.56,12.7 35.56,8.89 40.64,8.89 40.64,5.08 63.75,5.08 63.75,43.69 32.26,43.69 32.26,40.64 25.15,40.64 25.15,50.8 73.66,50.8 73.66,0 32.64,0
  pour Bottom: 25.15,40.64 32.26,40.64 32.26,43.69 73.41,43.69 73.53,43.81 73.53,50.67 25.15,50.67
  pour Bottom (no thermals): 32.64,12.7 35.56,12.7 35.56,8.89 40.64,8.89 40.64,5.08 73.66,5.08 73.66,0 32.77,0 32.64,0.13
  pour Top (no thermals): 6.35,37.21 12.7,37.21 12.7,30.86 9.78,27.94 6.35,27.94

### Text on the board
tNames: KRP | 0.hayate
bNames: A | B | C | hallsens | BL_MotaDora-Mod.1